# Altium schematic sheet 遥控器板子.schdoc
size 601 x 429 mm; Symbol: Drawing-Symbol_A4; Device: Drawing-Symbol_A4; Company: 嘉立创EDA; Version: V1.0; Page Size: A4; @Project Name: 遥控器板子; @Page Count: 1; @Update Date: 2025-12-18; @Create Date: 2025-12-04; @Schematic Name: Schematic1; @Page No: 1; @Page Name: 主控; @Board Name: Board1; @Create Time: 17:17:01; @Update Time: 14:19:12; Title Block Position: 3; Size: A4; Width: 2338; Height: 1652; Region Start: 1; X Region Count: 6; Y Region Count: 4; Blade Width: 10
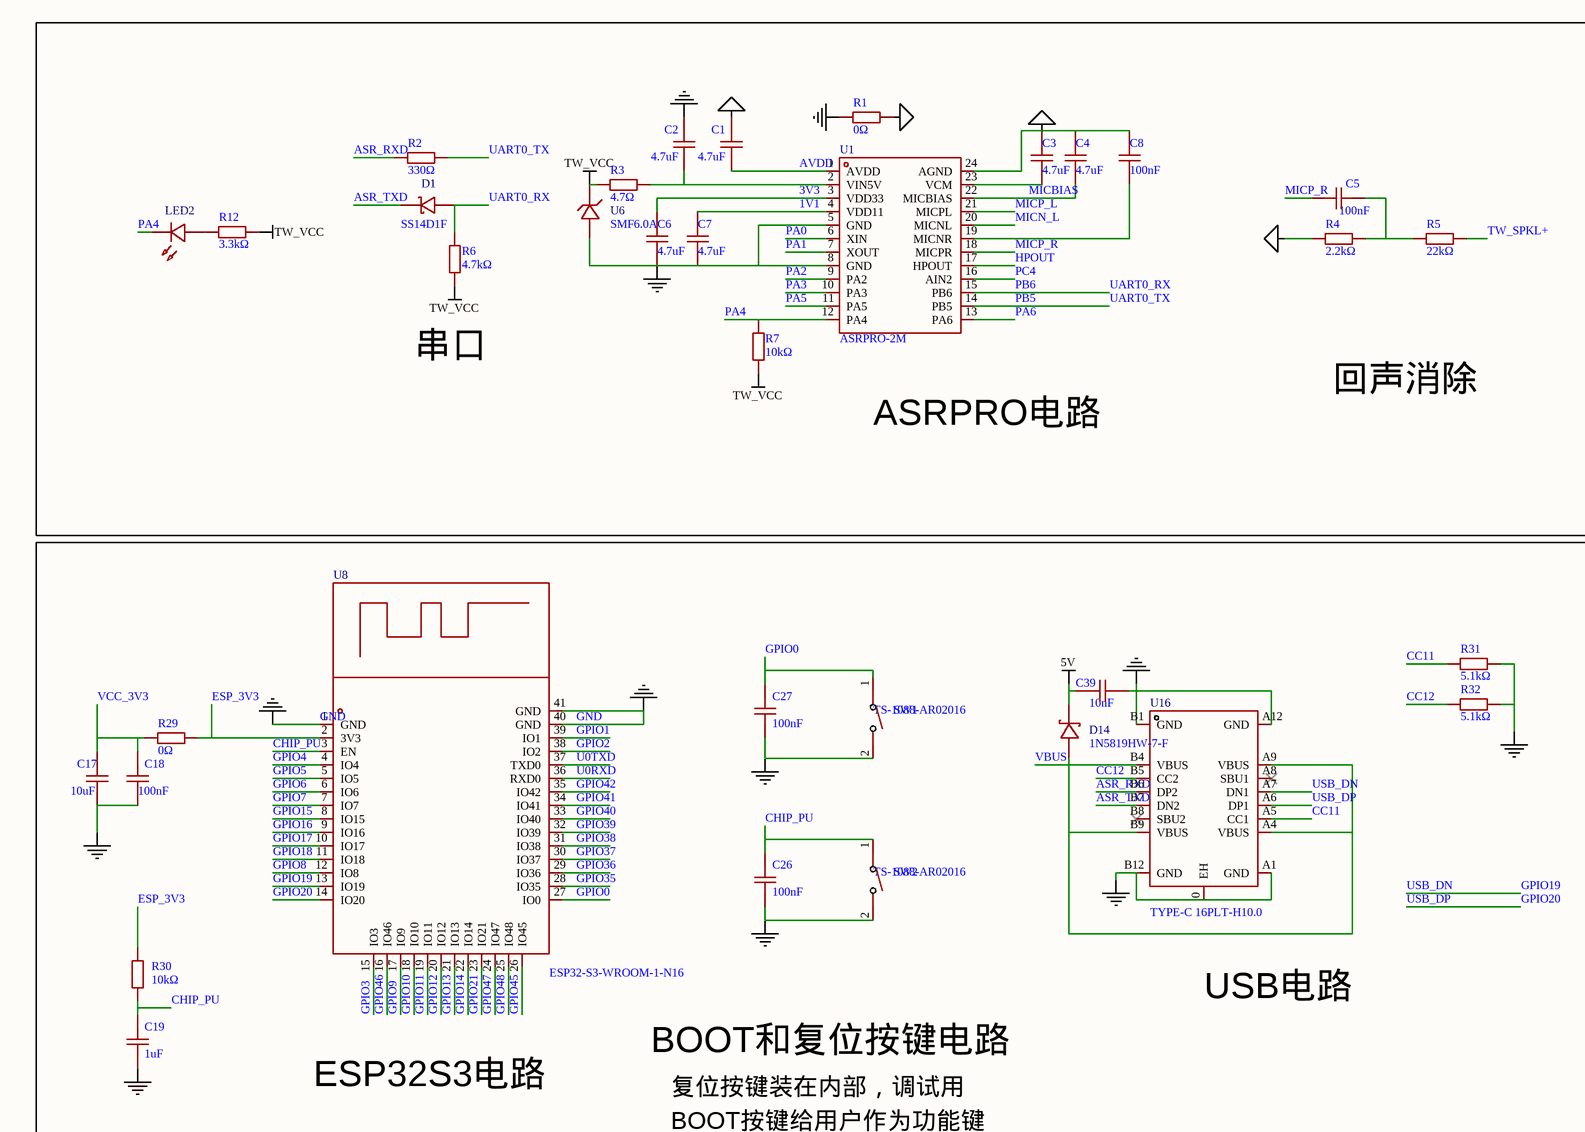
[diagram p0: 遥控器板子.schdoc, top left]
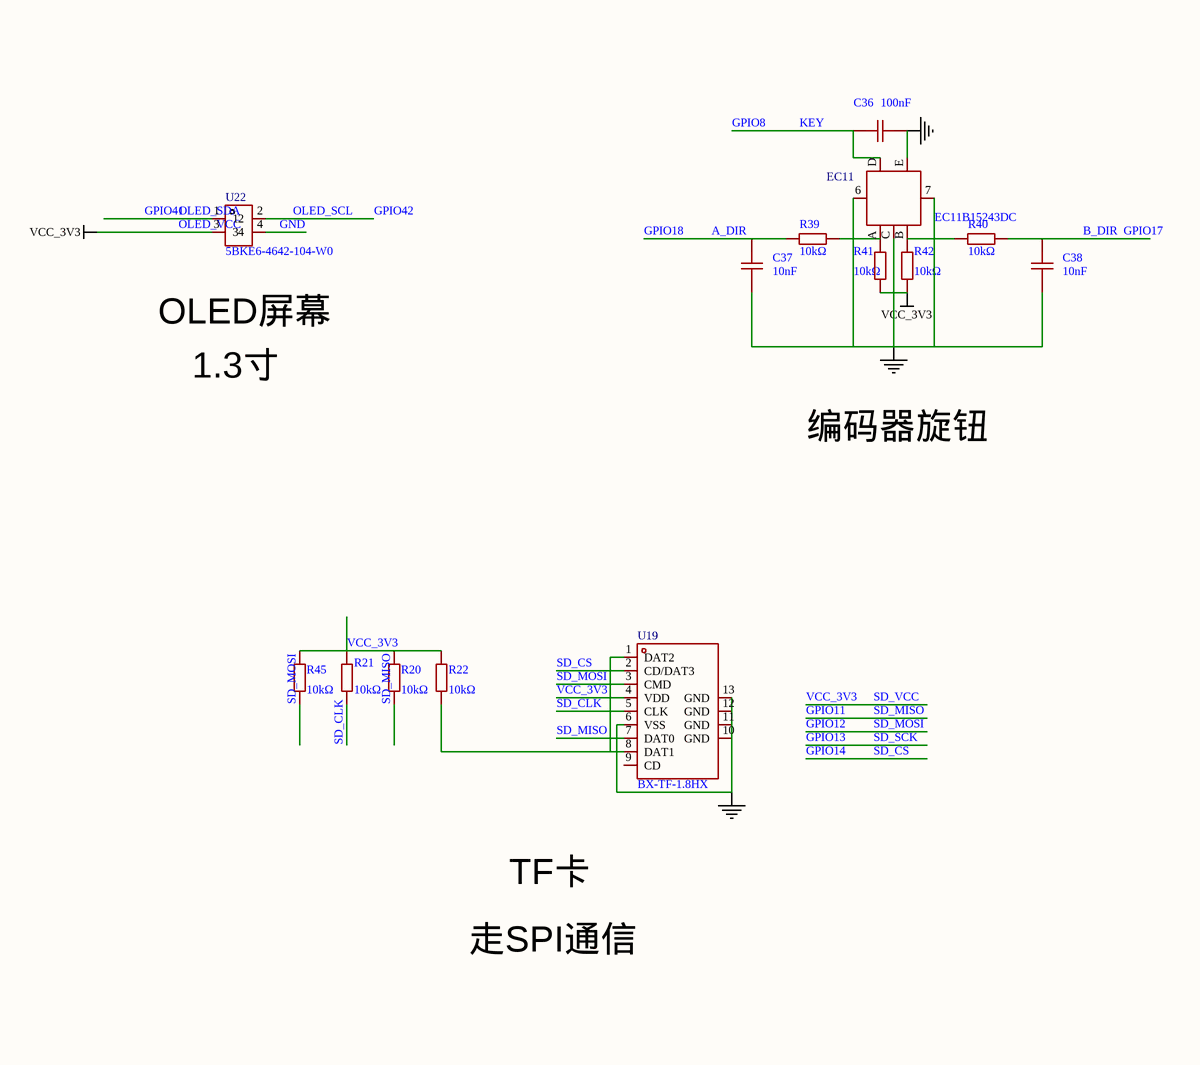
[diagram p1: 遥控器板子.schdoc, top right]
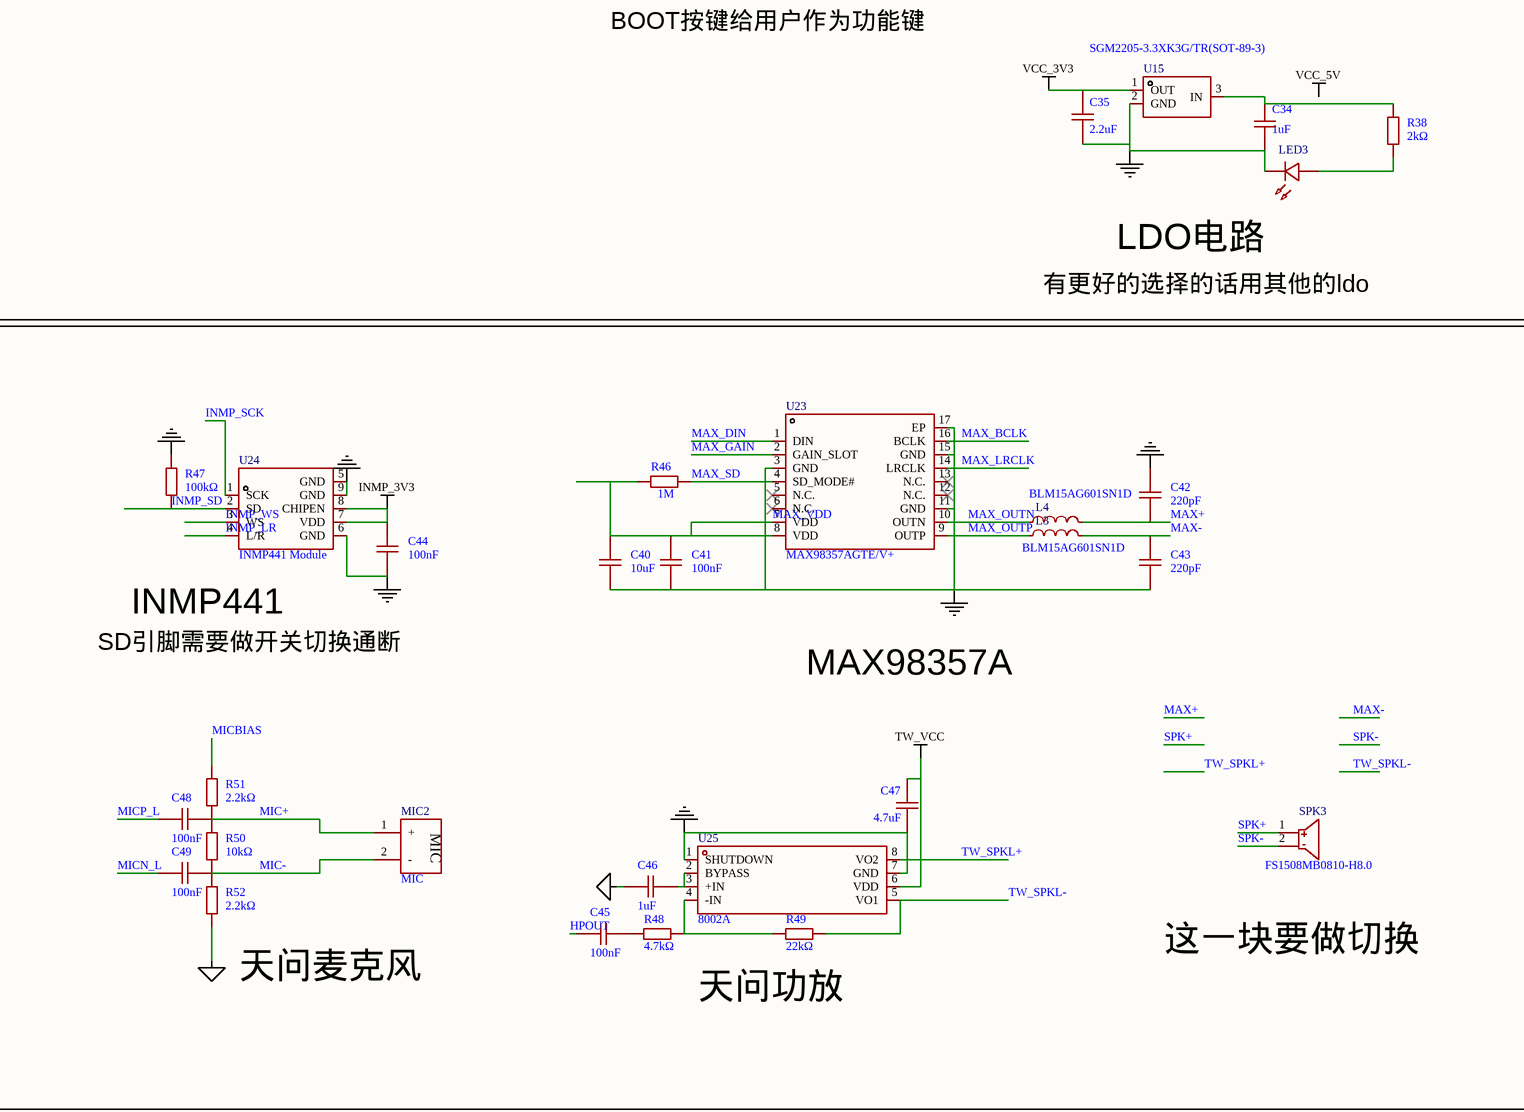
[diagram p2: 遥控器板子.schdoc, bottom left]
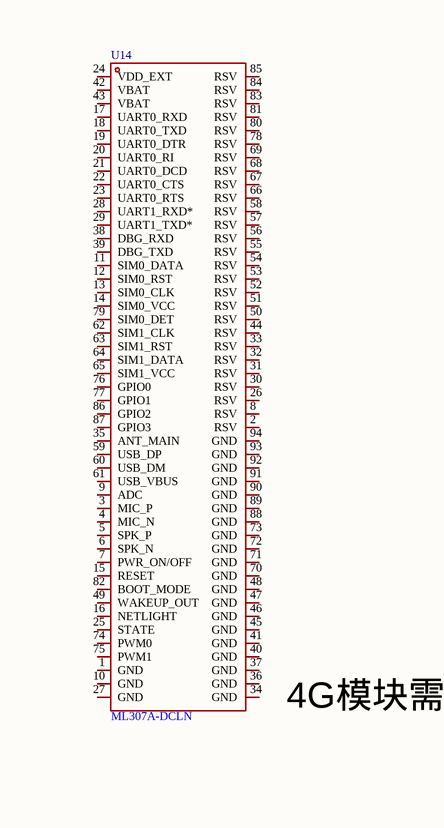
[diagram p3: 遥控器板子.schdoc, bottom right]

## Parts
C1  4.7uF  [C0402]
C2  4.7uF  [C0402]
C3  4.7uF  [C0402]
C4  4.7uF  [C0402]
C5  100nF  [C0402]
C6  4.7uF  [C0402]
C7  4.7uF  [C0402]
C8  100nF  [C0402]
C17  10uF  [C0402]
C18  100nF  [C0402]
C19  1uF  [C0402]
C26  100nF  [C0402]
C27  100nF  [C0402]
C34  1uF  [C0402]
C35  2.2uF  [C0402]
C36  100nF  [C0402]
C37  10nF  [C0402]
C38  10nF  [C0402]
C39  10nF  [C0402]
C40  10uF  [C0402]
C41  100nF  [C0402]
C42  220pF  [C0402]
C43  220pF  [C0402]
C44  100nF  [C0402]
C45  100nF  [C0402]
C46  1uF  [C0402]
C47  4.7uF  [C0402]
C48  100nF  [C0402]
C49  100nF  [C0402]
D1  SS14D1F  [SOD-123_L2.8-W1.8-LS3.7-RD]
D14  1N5819HW-7-F  [SOD-123_L2.7-W1.6-LS3.7-RD]
EC11  EC11B15243DC  [SW-TH_EC11B15243DC]
L3  BLM15AG601SN1D  [L0402]
L4  BLM15AG601SN1D  [L0402]
LED2  (no value)  [LED_0402]
LED3  (no value)  [LED_0402]
MIC2  MIC  [MIC-TH_BD6.0-P2.00]
R1  0Ω  [R0402]
R2  330Ω  [R0402]
R3  4.7Ω  [R0402]
R4  2.2kΩ  [R0402]
R5  22kΩ  [R0402]
R6  4.7kΩ  [R0402]
R7  10kΩ  [R0402]
R12  3.3kΩ  [R0402]
R20  10kΩ  [R0402]
R21  10kΩ  [R0402]
R22  10kΩ  [R0402]
R29  0Ω  [R0402]
R30  10kΩ  [R0402]
R31  5.1kΩ  [R0402]
R32  5.1kΩ  [R0402]
R38  2kΩ  [R0402]
R39  10kΩ  [R0402]
R40  10kΩ  [R0402]
R41  10kΩ  [R0402]
R42  10kΩ  [R0402]
R45  10kΩ  [R0402]
R46  1M  [R0402]
R47  100kΩ  [R0402]
R48  4.7kΩ  [R0402]
R49  22kΩ  [R0402]
R50  10kΩ  [R0402]
R51  2.2kΩ  [R0402]
R52  2.2kΩ  [R0402]
SPK3  FS1508MB0810-H8.0  [BEEP-TH_BD15.0-P10.20-D1.2]
SW1  TS-1088-AR02016  [SW-SMD_L3.9-W3.0-P4.45]
SW2  TS-1088-AR02016  [SW-SMD_L3.9-W3.0-P4.45]
U1  ASRPRO-2M  [SSOP-24_L8.7-W3.9-P0.64-LS6.0-BL-1]
U6  SMF6.0A  [SOD-123FL_L2.8-W1.8-LS3.8-RD]
U8  ESP32-S3-WROOM-1-N16  [WIRELM-SMD_ESP32-S3-WROOM-1]
U14  ML307A-DCLN  [LGA-94_L17.7-W15.8_N706-CA-01-S1]
U15  SGM2205-3.3XK3G/TR(SOT-89-3)  [SOT-89-3_L4.3-W2.3-P1.50-LS4.3-BR]
U16  TYPE-C 16PLT-H10.0  [TYPE-C-SMD_USB4120-03-C]
U19  BX-TF-1.8HX  [TF-SMD_BX-TF-1.8HJ]
U22  5BKE6-4642-104-W0  [CONN-SMD_4P-P1.99_5BKE6-4642-104-W0]
U23  MAX98357AGTE/V+  [TQFN-16_L3.0-W3.0-P0.50-BL-EP1.1]
U24  INMP441 Module  [MID-SMD_L4.7-W3.8_INMP441ACEZ]
U25  8002A  [SOP-8_L4.9-W3.9-P1.27-LS6.0-BL]

## Nets
5V: C39.1 D14.1(K)
AGND: C1.2 C3.2 C4.2 C8.2 C46.2 R1.2 R4.1 R52.2 U1.24(AGND)
GND: C2.2 C6.1 C7.1 C17.1 C18.1 C19.1 C26.1 C27.1 C34.1 C35.2 C36.1 C37.1 C38.1 C39.2 C40.1 C41.1 C42.2 C43.1 C44.1 C47.2 EC11.6(EH) EC11.7(EH) EC11.C EC11.E LED3.1(C) R1.1 R31.2 R32.2 R47.2 SW1.2 SW2.2 U1.5(GND) U1.8(GND) U6.2(A) U8.1(GND) U8.40(GND) U8.41(GND) U15.2(GND) U16.0(EH) U16.A1(GND) U16.A12(GND) U16.B1(GND) U16.B12(GND) U19.6(VSS) U19.10(GND) U19.11(GND) U19.12(GND) U19.13(GND) U22.4 U23.3(GND) U23.11(GND) U23.15(GND) U23.17(EP) U24.5(GND) U24.6(GND) U24.9(GND) U25.1(SHUTDOWN) U25.7(GND)
INMP_3V3: C44.2 U24.7(VDD) U24.8(CHIPEN)
OLED_VCC: C17.2 C18.2 C35.1 R20.1 R21.1 R22.1 R29.1 R41.1 R42.2 R45.1 U15.1(OUT) U19.4(VDD) U22.3  [also labelled SD_VCC, VCC_3V3]
TW_VCC: C47.1 R3.1 R6.1 R7.1 R12.1 U6.1(C) U25.6(VDD)
1V1: C7.2 U1.4(VDD11)
3V3: C6.2 U1.3(VDD33)
A_DIR: C37.2 R39.2 U8.11(IO18)  [also labelled GPIO18]
ASR_RXD: R2.1 U16.B6(DP2)
ASR_TXD: D1.1 U16.B7(DN2)
AVDD: C1.1 U1.1(AVDD)
B_DIR: C38.2 R40.1 U8.10(IO17)  [also labelled GPIO17]
CC11: R31.1 U16.A5(CC1)
CC12: R32.1 U16.B5(CC2)
CHIP_PU: C19.2 C26.2 R30.1 SW2.1 U8.3(EN)
ESP_3V3: R29.2 R30.2 U8.2(3V3)
GPIO0: C27.2 SW1.1 U8.27(IO0)
GPIO1: U8.39(IO1)
GPIO2: U8.38(IO2)
GPIO3: U8.15(IO3)
GPIO4: U8.4(IO4)
GPIO5: U8.5(IO5)
GPIO6: U8.6(IO6)
GPIO7: U8.7(IO7)
GPIO8: C36.2 EC11.D U8.12(IO8)  [also labelled KEY]
GPIO9: U8.17(IO9)
GPIO10: U8.18(IO10)
GPIO11: R20.2 U8.19(IO11) U19.7(DAT0)  [also labelled SD_MISO]
GPIO12: R45.2 U8.20(IO12) U19.3(CMD)  [also labelled SD_MOSI]
GPIO13: U8.21(IO13)  [also labelled SD_SCK]
GPIO14: U8.22(IO14) U19.2(CD/DAT3)  [also labelled SD_CS]
GPIO15: U8.8(IO15)
GPIO16: U8.9(IO16)
GPIO19: U8.13(IO19) U16.A7(DN1)  [also labelled USB_DN]
GPIO20: U8.14(IO20) U16.A6(DP1)  [also labelled USB_DP]
GPIO21: U8.23(IO21)
GPIO35: U8.28(IO35)
GPIO36: U8.29(IO36)
GPIO37: U8.30(IO37)
GPIO38: U8.31(IO38)
GPIO39: U8.32(IO39)
GPIO40: U8.33(IO40)
GPIO41: U8.34(IO41) U22.1  [also labelled OLED_SDA]
GPIO42: U8.35(IO42) U22.2  [also labelled OLED_SCL]
GPIO45: U8.26(IO45)
GPIO46: U8.16(IO46)
GPIO47: U8.24(IO47)
GPIO48: U8.25(IO48)
HPOUT: C45.2 U1.17(HPOUT)
INMP_LR: U24.4(L/R)
INMP_SCK: U24.1(SCK)
INMP_SD: R47.1 U24.2(SD)
INMP_WS: U24.3(WS)
MAX+: C42.1 L4.2
MAX-: C43.2 L3.2
MAX_BCLK: U23.16(BCLK)
MAX_DIN: U23.1(DIN)
MAX_GAIN: U23.2(GAIN_SLOT)
MAX_LRCLK: U23.14(LRCLK)
MAX_OUTN: L4.1 U23.10(OUTN)
MAX_OUTP: L3.1 U23.9(OUTP)
MAX_SD: R46.1 U23.4(SD_MODE#)
MAX_VDD: C40.2 C41.2 R46.2 U23.7(VDD) U23.8(VDD)
MIC+: C48.1 MIC2.1(+) R50.2 R51.1
MIC-: C49.1 MIC2.2(-) R50.1 R52.1
MICBIAS: C4.1 R51.2 U1.22(MICBIAS)
MICN_L: C49.2 U1.20(MICNL)
MICP_L: C48.2 U1.21(MICPL)
MICP_R: C5.1 U1.18(MICPR)
PA0: U1.6(XIN)
PA1: U1.7(XOUT)
PA2: U1.9(PA2)
PA3: U1.10(PA3)
PA4: LED2.1(C) R7.2 U1.12(PA4)
PA5: U1.11(PA5)
PA6: U1.13(PA6)
PB5: R2.2 U1.14(PB5)  [also labelled UART0_TX]
PB6: D1.2 R6.2 U1.15(PB6)  [also labelled UART0_RX]
PC4: U1.16(AIN2)
SD_CLK: R21.2 U19.5(CLK)
SPK+: SPK3.1
SPK-: SPK3.2
TW_SPKL+: R5.2 U25.8(VO2)
TW_SPKL-: R49.1 U25.5(VO1)
U0RXD: U8.36(RXD0)
U0TXD: U8.37(TXD0)
VBUS: D14.2(A) U16.A4(VBUS) U16.A9(VBUS) U16.B4(VBUS) U16.B9(VBUS)
NetC2_1: C2.1 R3.2 U1.2(VIN5V)
NetC3_1: C3.1 U1.23(VCM)
NetC5_2: C5.2 R4.2 R5.1
NetC8_1: C8.1 U1.19(MICNR)
NetC34_2: C34.2 R38.2 U15.3(IN)
NetC45_1: C45.1 R48.1
NetC46_1: C46.1 U25.2(BYPASS) U25.3(+IN)
NetEC11_A: EC11.A R39.1 R41.2
NetEC11_B: EC11.B R40.2 R42.1
NetLED2_2: LED2.2(A) R12.2
NetLED3_2: LED3.2(A) R38.1
NetR22_2: R22.2 U19.1(DAT2) U19.8(DAT1)
NetR48_2: R48.2 R49.2 U25.4(-IN)

Not connected (* = marked no-connect by the designer): U14 1(GND) 2(RSV) 3(MIC_P) 4(MIC_N) 5(SPK_P) 6(SPK_N) 7(PWR_ON/OFF) 8(RSV) 9(ADC) 10(GND) 11(SIM0_DATA) 12(SIM0_RST) 13(SIM0_CLK) 14(SIM0_VCC) 15(RESET) 16(NETLIGHT) 17(UART0_RXD) 18(UART0_TXD) 19(UART0_DTR) 20(UART0_RI) 21(UART0_DCD) 22(UART0_CTS) 23(UART0_RTS) 24(VDD_EXT) 25(STATE) 26(RSV) 27(GND) 28(UART1_RXD*) 29(UART1_TXD*) 30(RSV) 31(RSV) 32(RSV) 33(RSV) 34(GND) 35(ANT_MAIN) 36(GND) 37(GND) 38(DBG_RXD) 39(DBG_TXD) 40(GND) 41(GND) 42(VBAT) 43(VBAT) 44(RSV) 45(GND) 46(GND) 47(GND) 48(GND) 49(WAKEUP_OUT) 50(RSV) 51(RSV) 52(RSV) 53(RSV) 54(RSV) 55(RSV) 56(RSV) 57(RSV) 58(RSV) 59(USB_DP) 60(USB_DM) 61(USB_VBUS) 62(SIM1_CLK) 63(SIM1_RST) 64(SIM1_DATA) 65(SIM1_VCC) 66(RSV) 67(RSV) 68(RSV) 69(RSV) 70(GND) 71(GND) 72(GND) 73(GND) 74(PWM0) 75(PWM1) 76(GPIO0) 77(GPIO1) 78(RSV) 79(SIM0_DET) 80(RSV) 81(RSV) 82(BOOT_MODE) 83(RSV) 84(RSV) 85(RSV) 86(GPIO2) 87(GPIO3) 88(GND) 89(GND) 90(GND) 91(GND) 92(GND) 93(GND) 94(GND); U16 A8(SBU1)* B8(SBU2)*; U19 9(CD); U23 5(N.C.)* 6(N.C.)* 12(N.C.)* 13(N.C.)*

## Notes on the sheet
- 串口
- 回声消除
- OLED屏幕
- 1.3寸
- ASRPRO电路
- 编码器旋钮
- TF卡
- 走SPI通信
- BOOT和复位按键电路
- USB电路
- ESP32S3电路
- 复位按键装在内部，调试用
- BOOT按键给用户作为功能键
- 有更好的选择的话用其他的ldo
- LDO电路
- (near U24) INMP441
- SD引脚需要做开关切换通断
- MAX98357A
- (near U14) 4G模块需要做开关
- 这一块要做切换
- (near R52) 天问麦克风
- 天问功放
- Labels drawn without touching a wire or pin: VCC_5V
- 1
- 2
- 3
- 4
- 5
- 6
- A
- B
- C
- D
- 原理图
- Schematic1
- 创建日期
- 更新日期
- 2025-12-04
- 2025-12-18
- 板子
- 绘制
- Board1
- 图页
- 主控
- 审阅
- 版本
- 尺寸
- 遥控器板子
- 页    1    共    1
- V1.0
- A4
- 嘉立创EDA

## Library data of the parts
C1-C4 C6 C7 C47 = CL05A475MP5NRNC: Manufacturer: SAMSUNG(三星); Symbol: Capacitance; Add into BOM: yes; Tolerance: ±20%; Voltage Rating: 10V; Temperature Coefficient: X5R; Device: CL05A475MP5NRNC; LCSC Part Name: 4.7uF ±20% 10V; Supplier Part: C23733; Manufacturer Part: CL05A475MP5NRNC; Supplier Footprint: 0402; JLCPCB Part Class: Basic Part; Datasheet: https://item.szlcsc.com/datasheet/CL05A475MP5NRNC/24469.html; Supplier: LCSC; Convert to PCB: yes; Value: 4.7uF
C5 C8 C18 C26 C27 C36 C41 C44 C45 C48 C49 = CL05B104KO5NNNC: Manufacturer: SAMSUNG(三星); Symbol: Capacitance; Add into BOM: yes; Tolerance: ±10%; Voltage Rating: 16V; Temperature Coefficient: X7R; Device: CL05B104KO5NNNC; LCSC Part Name: 100nF ±10% 16V; Supplier Part: C1525; Manufacturer Part: CL05B104KO5NNNC; Supplier Footprint: 0402; JLCPCB Part Class: Basic Part; Datasheet: https://item.szlcsc.com/datasheet/CL05B104KO5NNNC/1877.html; Supplier: LCSC; Convert to PCB: yes; Value: 100nF
C17 C40 = CL05A106MQ5NUNC: Manufacturer: SAMSUNG(三星); Symbol: Capacitance; Add into BOM: yes; Tolerance: ±20%; Voltage Rating: 6.3V; Temperature Coefficient: X5R; Device: CL05A106MQ5NUNC; LCSC Part Name: 10uF ±20% 6.3V; Supplier Part: C15525; Manufacturer Part: CL05A106MQ5NUNC; Supplier Footprint: 0402; JLCPCB Part Class: Basic Part; Datasheet: https://item.szlcsc.com/datasheet/CL05A106MQ5NUNC/16204.html; Supplier: LCSC; Convert to PCB: yes; Value: 10uF
C19 C34 C46 = CL05A105KP5NNNC: Manufacturer: SAMSUNG(三星); Symbol: Capacitance; Add into BOM: yes; Tolerance: ±10%; Voltage Rating: 10V; Temperature Coefficient: X5R; Device: CL05A105KP5NNNC; LCSC Part Name: 1uF ±10% 10V; Supplier Part: C14445; Manufacturer Part: CL05A105KP5NNNC; Supplier Footprint: 0402; JLCPCB Part Class: Extended Part; Datasheet: https://item.szlcsc.com/datasheet/CL05A105KP5NNNC/15107.html; Supplier: LCSC; Convert to PCB: yes; Value: 1uF
C35 = CL05A225MQ5NSNC: Manufacturer: SAMSUNG(三星); Symbol: Capacitance; Add into BOM: yes; Tolerance: ±20%; Voltage Rating: 6.3V; Temperature Coefficient: X5R; Device: CL05A225MQ5NSNC; LCSC Part Name: 2.2uF ±20% 6.3V; Supplier Part: C12530; Manufacturer Part: CL05A225MQ5NSNC; Supplier Footprint: 0402; JLCPCB Part Class: Basic Part; Datasheet: https://item.szlcsc.com/datasheet/CL05A225MQ5NSNC/13164.html; Supplier: LCSC; Convert to PCB: yes; Value: 2.2uF
C37-C39 = CL05B103KB5NNNC: Manufacturer: SAMSUNG(三星); Symbol: Capacitance; Add into BOM: yes; Tolerance: ±10%; Voltage Rating: 50V; Temperature Coefficient: X7R; Device: CL05B103KB5NNNC; LCSC Part Name: 10nF ±10% 50V; Supplier Part: C15195; Manufacturer Part: CL05B103KB5NNNC; Supplier Footprint: 0402; JLCPCB Part Class: Basic Part; Datasheet: https://item.szlcsc.com/datasheet/CL05B103KB5NNNC/15869.html; Supplier: LCSC; Convert to PCB: yes; Value: 10nF
C42 C43 = CAP_0402: Symbol: Capacitance; Convert to PCB: yes; Device: CAP_0402; Add into BOM: yes; Supplier Footprint: 0402; Value: 220pF
D1 = SS14D1F: Manufacturer: PN SILICON(智晶); Add into BOM: yes; Diode Configuration: 独立式; Forward Voltage (Vf@If): 550mV@1A; Reverse Voltage (Vr): 40V; Rectified Current: 1A; Reverse Leakage Current (Ir): 500uA@40V; Symbol: SS14D1F; Device: SS14D1F; LCSC Part Name: 电压:40V 电流:1A; Supplier Part: C555467; Manufacturer Part: SS14D1F; Supplier Footprint: SOD-123FL; JLCPCB Part Class: 扩展库; Datasheet: https://atta.szlcsc.com/upload/public/pdf/source/20200522/C555467_999C99989D3359609DD22682C5528FBD.pdf; Supplier: LCSC; Convert to PCB: yes
D14 = 1N5819HW-7-F: Manufacturer: DIODES(美台); Add into BOM: yes; Forward Voltage (Vf@If): 450mV@1A; Reverse Voltage (Vr): 40V; Rectified Current: 1A; Reverse Leakage Current (Ir): 1mA@40V; Symbol: 1N5819HW-7-F; Device: 1N5819HW-7-F; LCSC Part Name: 电压:40V 电流:1A; Supplier Part: C82544; Manufacturer Part: 1N5819HW-7-F; Supplier Footprint: SOD-123; JLCPCB Part Class: 扩展库; Datasheet: https://atta.szlcsc.com/upload/public/pdf/source/20161024/1477288459223.pdf; Supplier: LCSC; Convert to PCB: yes
EC11 = EC11B15243DC: Manufacturer: ALPSALPINE(阿尔卑斯阿尔派); Add into BOM: yes; Symbol: EC11B15243DC; Device: EC11B15243DC; LCSC Part Name: 编码器; Supplier Part: C1322537; Manufacturer Part: EC11B15243DC; Supplier Footprint: 插件; JLCPCB Part Class: 扩展库; Datasheet: https://atta.szlcsc.com/upload/public/pdf/source/20201225/C1322537_53FBDB6744E480A5610711E1B21D2397.pdf; Supplier: LCSC; Convert to PCB: yes
L3 L4 = BLM15AG601SN1D: Manufacturer: muRata(村田); Symbol: BLM18KG601SN1D; Add into BOM: yes; Impedance @ Frequency: 600Ω@100MHz; Tolerance: ±25%; DC Resistance: 520mΩ; Current Rating: 300mA; Circuits: 1; DC Resistance(DCR): 150mΩ; Device: BLM15AG601SN1D; LCSC Part Name: 单路 0402磁珠 阻抗600Ω@100MHz; Supplier Part: C76884; Manufacturer Part: BLM15AG601SN1D; Supplier Footprint: 0402; JLCPCB Part Class: Extended Part; Datasheet: https://atta.szlcsc.com/upload/public/pdf/source/20181120/C333978_3E581FB55966932B05020139ABDE8E01.pdf; Supplier: LCSC; Convert to PCB: yes; Number of Circuits: 1; Operating Temperature: -55℃~+125℃
LED2 LED3 = LED_0603-R: Symbol: LED_R; Convert to PCB: yes; Device: LED_0603-R; Add into BOM: yes; Supplier Footprint: 0603
MIC2 = MIC: Symbol: MIC_C9900023869; Add into BOM: yes; Device: MIC; LCSC Part Name: MIC; Supplier Part: C9900023869; Manufacturer Part: MIC; Supplier Footprint: THrough hole; JLCPCB Part Class: 扩展库; Supplier: LCSC; Convert to PCB: yes
R1 R29 = 0402WGF0000TCE: Manufacturer: UNI-ROYAL(厚声); Symbol: 0402WGF1002TCE; Add into BOM: yes; Tolerance: ±1%; Power(Watts): 62.5mW; Voltage-Supply(Max): 50V; Temperature Coefficient: ±800ppm/℃; Device: 0402WGF0000TCE; LCSC Part Name: 0Ω ±1% 62.5mW 厚膜电阻; Supplier Part: C17168; Manufacturer Part: 0402WGF0000TCE; Supplier Footprint: 0402; JLCPCB Part Class: Basic Part; Datasheet: https://item.szlcsc.com/datasheet/0402WGF0000TCE/17853.html; Supplier: LCSC; Convert to PCB: yes; Type: 厚膜电阻; Value: 0Ω; Operating Temperature: -55℃~+155℃
R2 = 0402WGF3300TCE: Manufacturer: UNI-ROYAL(厚声); Symbol: 0402WGF1002TCE; Add into BOM: yes; Tolerance: ±1%; Power(Watts): 62.5mW; Voltage-Supply(Max): 50V; Temperature Coefficient: ±100ppm/℃; Device: 0402WGF3300TCE; LCSC Part Name: 330Ω ±1% 62.5mW 厚膜电阻; Supplier Part: C25104; Manufacturer Part: 0402WGF3300TCE; Supplier Footprint: 0402; JLCPCB Part Class: Basic Part; Datasheet: https://item.szlcsc.com/datasheet/0402WGF3300TCE/25847.html; Supplier: LCSC; Convert to PCB: yes; Type: 厚膜电阻; Value: 330Ω; Operating Temperature: -55℃~+155℃
R3 = FRC0402F4R70TS: Manufacturer: FOJAN(富捷); Symbol: 0402WGF1002TCE; Add into BOM: yes; Tolerance: ±1%; Power(Watts): 62.5mW; Voltage-Supply(Max): 50V; Temperature Coefficient: ±200ppm/℃; Device: FRC0402F4R70TS; LCSC Part Name: 4.7Ω ±1% 62.5mW 厚膜电阻; Supplier Part: C2909356; Manufacturer Part: FRC0402F4R70TS; Supplier Footprint: 0402; JLCPCB Part Class: Extended Part; Supplier: LCSC; Convert to PCB: yes; Type: 厚膜电阻; Value: 4.7Ω; Operating Temperature: -55℃~+155℃
R4 R51 R52 = 0402WGF2201TCE: Manufacturer: UNI-ROYAL(厚声); Symbol: 0402WGF1002TCE; Add into BOM: yes; Tolerance: ±1%; Power(Watts): 62.5mW; Voltage-Supply(Max): 50V; Temperature Coefficient: ±100ppm/℃; Device: 0402WGF2201TCE; LCSC Part Name: 2.2kΩ ±1% 62.5mW 厚膜电阻; Supplier Part: C25879; Manufacturer Part: 0402WGF2201TCE; Supplier Footprint: 0402; JLCPCB Part Class: Basic Part; Datasheet: https://item.szlcsc.com/datasheet/0402WGF2201TCE/26622.html; Supplier: LCSC; Convert to PCB: yes; Type: 厚膜电阻; Value: 2.2kΩ; Operating Temperature: -55℃~+155℃
R5 R49 = 0402WGF2202TCE: Manufacturer: UNI-ROYAL(厚声); Symbol: 0402WGF1002TCE; Add into BOM: yes; Tolerance: ±1%; Power(Watts): 62.5mW; Voltage-Supply(Max): 50V; Temperature Coefficient: ±100ppm/℃; Device: 0402WGF2202TCE; LCSC Part Name: 22kΩ ±1% 62.5mW 厚膜电阻; Supplier Part: C25768; Manufacturer Part: 0402WGF2202TCE; Supplier Footprint: 0402; JLCPCB Part Class: Basic Part; Datasheet: https://item.szlcsc.com/datasheet/0402WGF2202TCE/26511.html; Supplier: LCSC; Convert to PCB: yes; Type: 厚膜电阻; Value: 22kΩ; Operating Temperature: -55℃~+155℃
R6 R48 = 0402WGF4701TCE: Manufacturer: UNI-ROYAL(厚声); Symbol: 0402WGF1002TCE; Add into BOM: yes; Tolerance: ±1%; Power(Watts): 62.5mW; Voltage-Supply(Max): 50V; Temperature Coefficient: ±100ppm/℃; Device: 0402WGF4701TCE; LCSC Part Name: 4.7kΩ ±1% 62.5mW 厚膜电阻; Supplier Part: C25900; Manufacturer Part: 0402WGF4701TCE; Supplier Footprint: 0402; JLCPCB Part Class: Basic Part; Datasheet: https://item.szlcsc.com/datasheet/0402WGF4701TCE/26643.html; Supplier: LCSC; Convert to PCB: yes; Type: 厚膜电阻; Value: 4.7kΩ; Operating Temperature: -55℃~+155℃
R7 R20-R22 R30 R39-R42 R45 R50 = 0402WGF1002TCE: Manufacturer: UNI-ROYAL(厚声); Add into BOM: yes; Tolerance: ±1%; Power(Watts): 62.5mW; Voltage-Supply(Max): 50V; Temperature Coefficient: ±100ppm/℃; Symbol: 0402WGF1002TCE; Device: 0402WGF1002TCE; LCSC Part Name: 10kΩ ±1% 62.5mW 厚膜电阻; Supplier Part: C25744; Manufacturer Part: 0402WGF1002TCE; Supplier Footprint: 0402; JLCPCB Part Class: Basic Part; Datasheet: https://item.szlcsc.com/datasheet/0402WGF1002TCE/26487.html; Supplier: LCSC; Convert to PCB: yes; Type: 厚膜电阻; Value: 10kΩ; Operating Temperature: -55℃~+155℃
R12 = 0402WGF3301TCE: Manufacturer: UNI-ROYAL(厚声); Symbol: 0402WGF1002TCE; Add into BOM: yes; Tolerance: ±1%; Power(Watts): 62.5mW; Voltage-Supply(Max): 50V; Temperature Coefficient: ±100ppm/℃; Device: 0402WGF3301TCE; LCSC Part Name: 3.3kΩ ±1% 62.5mW 厚膜电阻; Supplier Part: C25890; Manufacturer Part: 0402WGF3301TCE; Supplier Footprint: 0402; JLCPCB Part Class: Basic Part; Datasheet: https://item.szlcsc.com/datasheet/0402WGF3301TCE/26633.html; Supplier: LCSC; Convert to PCB: yes; Type: 厚膜电阻; Value: 3.3kΩ; Operating Temperature: -55℃~+155℃
R31 R32 = 0402WGF5101TCE: Manufacturer: UNI-ROYAL(厚声); Add into BOM: yes; Tolerance: ±1%; Power(Watts): 62.5mW; Voltage-Supply(Max): 50V; Temperature Coefficient: ±100ppm/℃; Symbol: 0402WGF5101TCE; Device: 0402WGF5101TCE; LCSC Part Name: 5.1kΩ ±1% 62.5mW 厚膜电阻; Supplier Part: C25905; Manufacturer Part: 0402WGF5101TCE; Supplier Footprint: 0402; JLCPCB Part Class: Basic Part; Datasheet: https://item.szlcsc.com/datasheet/0402WGF5101TCE/26648.html; Supplier: LCSC; Convert to PCB: yes; Type: 厚膜电阻; Value: 5.1kΩ; Operating Temperature: -55℃~+155℃
R38 = 0402WGF2001TCE: Manufacturer: UNI-ROYAL(厚声); Symbol: 0402WGF1002TCE; Add into BOM: yes; Tolerance: ±1%; Power(Watts): 62.5mW; Overload Voltage (Max): 50V; Temperature Coefficient: ±100ppm/℃; Device: 0402WGF2001TCE; LCSC Part Name: 2kΩ ±1% 62.5mW 厚膜电阻; Supplier Part: C4109; Manufacturer Part: 0402WGF2001TCE; Supplier Footprint: 0402; JLCPCB Part Class: Basic Part; Datasheet: https://atta.szlcsc.com/upload/public/pdf/source/20200306/C422600_1E6D84923E4A46A82E41ADD87F860B5C.pdf; Supplier: LCSC; Convert to PCB: yes; Type: 厚膜电阻; Value: 2kΩ; Operating Temperature Range: -55℃~+155℃
R46 = Res_0402: Symbol: 0402WGF1002TCE; Convert to PCB: yes; Device: Res_0402; Add into BOM: yes; Supplier Footprint: 0402; Value: 1M
R47 = 0402WGF1003TCE: Manufacturer: UNI-ROYAL(厚声); Symbol: 0402WGF1002TCE; Add into BOM: yes; Tolerance: ±1%; Power(Watts): 62.5mW; Voltage-Supply(Max): 50V; Temperature Coefficient: ±100ppm/℃; Device: 0402WGF1003TCE; LCSC Part Name: 100kΩ ±1% 62.5mW 厚膜电阻; Supplier Part: C25741; Manufacturer Part: 0402WGF1003TCE; Supplier Footprint: 0402; JLCPCB Part Class: Basic Part; Datasheet: https://item.szlcsc.com/datasheet/0402WGF1003TCE/26484.html; Supplier: LCSC; Convert to PCB: yes; Type: 厚膜电阻; Value: 100kΩ; Operating Temperature: -55℃~+155℃
SPK3 = FS1508MB0810-H8.0: Manufacturer: FUET(福声科技); Add into BOM: yes; Symbol: FS1508MB0810-H8.0; Device: FS1508MB0810-H8.0; LCSC Part Name: 喇叭; Supplier Part: C969972; Manufacturer Part: FS1508MB0810-H8.0; Supplier Footprint: -; JLCPCB Part Class: 扩展库; Datasheet: https://atta.szlcsc.com/upload/public/pdf/source/20201214/C969972_AF680FD4EA01CCA3A240B6D561BC4FD9.pdf; Supplier: LCSC; Convert to PCB: yes
SW1 SW2 = TS-1088-AR02016: Manufacturer: XUNPU(讯普); Add into BOM: yes; Circuit: 单刀单掷; Actuator Style: 圆形按钮; Operating Force: 160gf; Switch Length: 4mm; Switch Width: 3mm; Switch Height: 2mm; Strike Gundam: 不带; Contact Current: 50mA; Voltage Rating (DC): 12V; Insulation Resistance: 100MΩ; Actuator/Cap Color: 黑色; Pin Style: SMD接片; Mechanical Life: 10万次; Symbol: TS-1088-AR02016; Device: TS-1088-AR02016; LCSC Part Name: 4*3*2mm 立贴 轻触开关; Supplier Part: C720477; Manufacturer Part: TS-1088-AR02016; Supplier Footprint: SMD; JLCPCB Part Class: Basic Part; Datasheet: https://atta.szlcsc.com/upload/public/pdf/source/20200810/C720475_60D09DD6C54279ADDB2DC25100F1CC11.pdf; Supplier: LCSC; Convert to PCB: yes; Mounting Style: 立贴; Operating Temperature: -30℃~+80℃
U1 = ASRPRO-2M: Add into BOM: yes; Symbol: ASRPRO-2M; Device: ASRPRO-2M; LCSC Part Name: ASRPRO-2M; Supplier Part: C9900044331; Manufacturer Part: ASRPRO-2M; Supplier Footprint: SSOP24-0.635-8.65X4MM; JLCPCB Part Class: 扩展库; Supplier: LCSC; Convert to PCB: yes
U6 = SMF6.0A: Manufacturer: GOODWORK(固得沃克); Symbol: SMF6.0A_C2980406; Add into BOM: yes; Polarity: 单向; Reverse Stand-Off Voltage (Vrwm): 6V; Clamping Voltage: 10.3V; Peak Pulse Current (Ipp): 19.4A; Peak Pulse Power Dissipation (Ppp): 200W; Voltage - Breakdown: 6.67V; Reverse Leakage Current (Ir): 400uA; Number of Channels: 单路; Device: SMF6.0A; LCSC Part Name: 单向TVS 6V截止 19.4A峰值脉冲; Supplier Part: C2980406; Manufacturer Part: SMF6.0A; Supplier Footprint: SOD-123FL; JLCPCB Part Class: 扩展库; Datasheet: https://atta.szlcsc.com/upload/public/pdf/source/20240508/80D6E9463317C72355489DDC2072889A.pdf; Supplier: LCSC; Convert to PCB: yes; Operating Temperature: -55℃~+150℃@(Tj); Type: TVS
U8 = ESP32-S3-WROOM-1-N16: Manufacturer: ESPRESSIF(乐鑫); Add into BOM: yes; Symbol: ESP32-S3-WROOM-1-N16; Device: ESP32-S3-WROOM-1-N16; LCSC Part Name: 通用型Wi-Fi+低功耗蓝牙MCU模组; Supplier Part: C2913199; Manufacturer Part: ESP32-S3-WROOM-1-N16; Supplier Footprint: SMD,18x25.5mm; Datasheet: https://atta.szlcsc.com/upload/public/pdf/source/20241030/6A412B13087E1327DF6279F5735253CA.pdf; Supplier: LCSC; Convert to PCB: yes
U14 = ML307A-DCLN_C9900089086: Add into BOM: yes; Symbol: ML307A-DCLN_C9900089086; Device: ML307A-DCLN_C9900089086; LCSC Part Name: ML307A-DCLN; Supplier Part: C9900089086; Manufacturer Part: ML307A-DCLN; Supplier Footprint: ML307A-GF; JLCPCB Part Class: 扩展库; Supplier: LCSC; Convert to PCB: yes
U15 = SGM2205-3.3XK3G/TR(SOT-89-3): Add into BOM: yes; Symbol: SGM2205-3.3XK3G/TR(SOT-89-3); Device: SGM2205-3.3XK3G/TR(SOT-89-3); LCSC Part Name: SGM2205-3.3XK3G/TR(SOT-89-3); Supplier Part: C9900095203; Manufacturer Part: SGM2205-3.3XK3G/TR(SOT-89-3); Supplier Footprint: SOT89; JLCPCB Part Class: 扩展库; Supplier: LCSC; Convert to PCB: yes
U16 = TYPE-C 16PLT-H10.0: Manufacturer: SHOU HAN(首韩); Add into BOM: yes; Protocol Standard: USB 3.1; Gender: 母; Number of Contacts: 16P; Number of Ports: 1; Current Rating-Power: 5A; Voltage Rating: 20V; Connect-Disconnect Life: 1万次; Detection color: 黑色; Symbol: TYPE-C 16PLT-H10.0; Device: TYPE-C 16PLT-H10.0; LCSC Part Name: Type-C 母 立贴; Supplier Part: C3151749; Manufacturer Part: TYPE-C 16PLT-H10.0; Supplier Footprint: SMD; JLCPCB Part Class: 扩展库; Datasheet: https://item.szlcsc.com/datasheet/TYPE-C%252016PLT-H10.0/3712567.html; Supplier: LCSC; Convert to PCB: yes; Connector Type: Type-C; Mounting Type: 立贴; Operating Temperature: -40℃~+85℃
U19 = BX-TF-1.8HX: Manufacturer: Bossie(博锡); Add into BOM: yes; Card Connection Mode: 自弹式; Card Type: MicroSD卡(TF卡); Connector Type: 卡座; Maximum Body Height: 2.8mm; Symbol: BX-TF-1.8HX; Device: BX-TF-1.8HX; LCSC Part Name: 自弹式 MicroSD卡(TF卡) 卡座; Supplier Part: C18077681; Manufacturer Part: BX-TF-1.8HX; Supplier Footprint: SMD; JLCPCB Part Class: 扩展库; Datasheet: https://atta.szlcsc.com/upload/public/pdf/source/20231017/6449D811750430F40575758A7692B55B.pdf; Supplier: LCSC; Convert to PCB: yes; Operating Temperature Range: -45℃~+85℃
U22 = 5BKE6-4642-104-W0: Manufacturer: SAMZO(三佐); Add into BOM: yes; Holes Structure: 1x4P; Pitch: 2mm; Circular Hole / Square Hole: 方孔; Number of Positions: 4P; Current Rating: 1.5A; Holes Direction: 顶部; Symbol: 5BKE6-4642-104-W0; Device: 5BKE6-4642-104-W0; LCSC Part Name: 1x4P 间距:2mm 立贴; Supplier Part: C39832932; Manufacturer Part: 5BKE6-4642-104-W0; Supplier Footprint: SMD,P=2mm(交错脚); JLCPCB Part Class: 扩展库; Datasheet: https://item.szlcsc.com/datasheet/5BKE6-4642-104-W0/41562127.html; Supplier: LCSC; Convert to PCB: yes; Row Spacing: -; Mounting Type: 立贴; Number of Rows: 单排; Voltage Rating (Max): -; Insulation Height: 4.3mm; Contact Material: 黄铜; Contact Plating: 金; Operating Temperature: -40℃~+105℃
U23 = MAX98357AGTE/V+: Manufacturer: ADI(亚德诺)/MAXIM(美信); Add into BOM: yes; Class: D类功放; Output Power: 3.2W×1@4Ω; Voltage - Supply: 2.5V~5.5V; Total Harmonic Distortion + Noise (THD+N): 0.013%; Quiescent Current: 3.35mA; Power Supply Rejection Ratio (PSRR): 77dB; Efficiency: 92%; Symbol: MAX98357AGTE/V+; Device: MAX98357AGTE/V+; LCSC Part Name: MAX98357AGTE/V+; Supplier Part: C23890844; Manufacturer Part: MAX98357AGTE/V+; Supplier Footprint: TQFN-16(3x3); Datasheet: https://item.szlcsc.com/datasheet/MAX98357AGTE%252FV%252B/25620670.html; Supplier: LCSC; Convert to PCB: yes; Operating Temperature: -40℃~+85℃
U24 = INMP441 Module: Add into BOM: yes; Symbol: INMP441 MODULE; Device: INMP441 Module; LCSC Part Name: INMP441 Module; Supplier Part: C9900169261; Manufacturer Part: INMP441 Module; Supplier Footprint: LGA-9; JLCPCB Part Class: 扩展库; Supplier: LCSC; Convert to PCB: yes
U25 = 8002A: Manufacturer: IDCHIP(英锐芯); Add into BOM: yes; Speaker Channels: 单声道; Output Power: 3Wx1@4Ω; Voltage - Supply: 2.2V~5.5V; Symbol: 8002A; Device: 8002A; LCSC Part Name: 8002A; Supplier Part: C329448; Manufacturer Part: 8002A; Supplier Footprint: SOP-8; JLCPCB Part Class: 扩展库; Datasheet: https://item.szlcsc.com/datasheet/8002A/309702.html; Supplier: LCSC; Convert to PCB: yes; Class: -; Quiescent Current: -; Operating Temperature: -